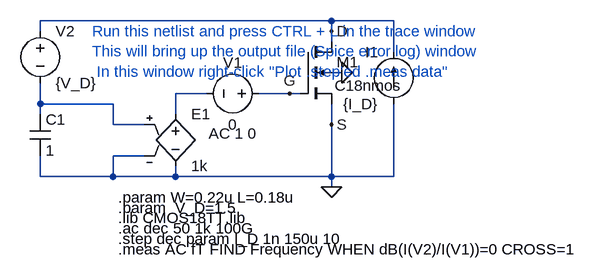
[diagram p0: schematic NMOS-fT-testbench.asc]
NMOS-fT-testbench.asc, the LTspice schematic file:
Version 4
SHEET 1 880 680
WIRE 80 48 -368 48
WIRE 176 48 80 48
WIRE -368 64 -368 48
WIRE 80 64 80 48
WIRE 80 80 80 64
WIRE 176 96 176 48
WIRE 96 128 80 128
WIRE -112 160 -160 160
WIRE 16 160 -32 160
WIRE 32 160 16 160
WIRE -368 176 -368 144
WIRE -256 176 -368 176
WIRE -368 192 -368 176
WIRE -160 192 -160 160
WIRE -256 208 -256 176
WIRE -208 208 -256 208
WIRE 80 208 80 176
WIRE -208 256 -256 256
WIRE -368 288 -368 256
WIRE -256 288 -256 256
WIRE -256 288 -368 288
WIRE -160 288 -160 272
WIRE -160 288 -256 288
WIRE 80 288 80 208
WIRE 80 288 -160 288
WIRE 176 288 176 176
WIRE 176 288 80 288
WIRE 80 304 80 288
FLAG 80 304 0
FLAG 96 128 0
FLAG 16 160 G
FLAG 80 208 S
FLAG 80 64 D
SYMBOL nmos4 32 80 R0
WINDOW 3 53 68 Left 2
SYMATTR Value C18nmos
SYMATTR InstName M1
SYMATTR Value2 l={L} w={W}
SYMBOL voltage -368 48 R0
SYMATTR InstName V2
SYMATTR Value {V_D}
SYMBOL current 176 176 R180
WINDOW 0 24 80 Left 2
WINDOW 3 24 0 Left 2
SYMATTR InstName I1
SYMATTR Value {I_D}
SYMBOL cap -384 192 R0
SYMATTR InstName C1
SYMATTR Value 1
SYMBOL voltage -16 160 R90
WINDOW 0 -32 56 VBottom 2
WINDOW 3 32 56 VTop 2
WINDOW 123 46 56 VTop 2
WINDOW 39 0 0 Left 0
SYMATTR InstName V1
SYMATTR Value 0
SYMATTR Value2 AC 1 0
SYMBOL e -160 176 R0
SYMATTR InstName E1
SYMATTR Value 1k
TEXT -248 320 Left 2 !.param W=0.22u L=0.18u
TEXT -248 336 Left 2 !.param  V_D=1.5
TEXT -248 368 Left 2 !.ac dec 50 1k 100G
TEXT -248 352 Left 2 !.lib CMOS18TT.lib
TEXT -248 384 Left 2 !.step dec param I_D 1n 150u 10
TEXT -248 400 Left 2 !.meas AC fT FIND Frequency WHEN dB(I(V2)/I(V1))=0 CROSS=1
TEXT -288 64 Left 2 ;Run this netlist and press CTRL + L in the trace window\nThis will bring up the output file (Spice error log) window\n In this window right-click "Plot .step’ed .meas data"

The netlist it stands for:
* NMOS-fT-testbench.asc
M1 D G 0 0 C18nmos l={L} w={W}
V2 D N002 {V_D}
I1 0 D {I_D}
C1 N002 0 1
V1 G N001 0 AC 1 0
E1 N001 0 N002 0 1k
.model NMOS NMOS
.model PMOS PMOS
.lib standard.mos
.param W=0.22u L=0.18u
.param  V_D=1.5
.ac dec 50 1k 100G
.lib CMOS18TT.lib
.step dec param I_D 1n 150u 10
.meas AC fT FIND Frequency WHEN dB(I(V2)/I(V1))=0 CROSS=1
* Run this netlist and press CTRL + L in the trace window
* This will bring up the output file (Spice error log) window
*  In this window right-click "Plot .step’ed .meas data"
.backanno
.end